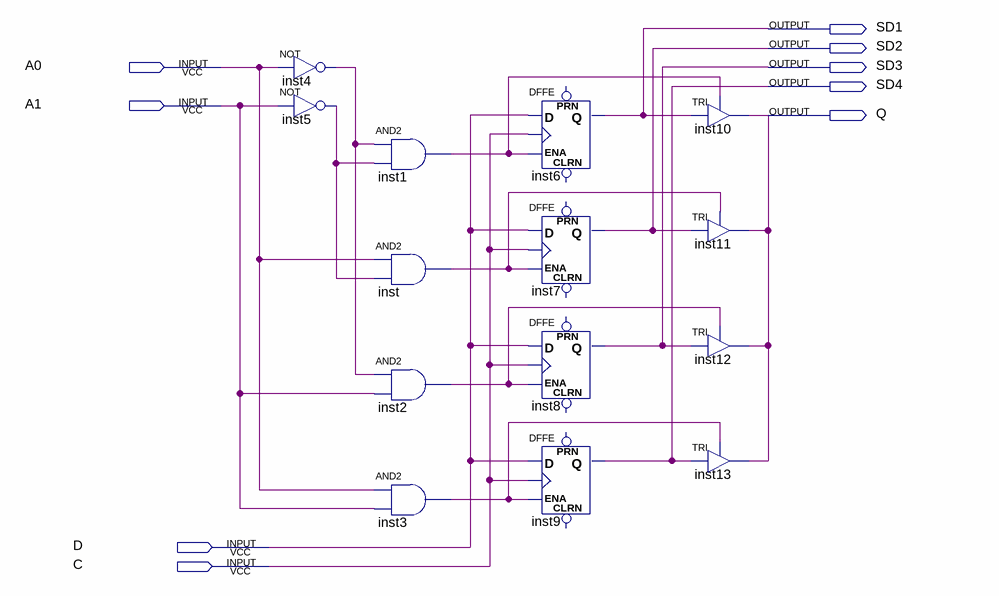
[diagram p0: schematic sheet]
// Quartus schematic Mem4.bdf as structural Verilog: 14 symbols, 9 pins
module Mem4 (
  input  A0,
  input  A1,
  input  D,
  input  C,
  output SD1,
  output SD2,
  output SD3,
  output SD4,
  output Q
);

  wire inst1_out, inst2_out, inst3_out, inst4_out, inst5_out, inst_out;

  not inst4 (inst4_out, A0);
  not inst5 (inst5_out, A1);
  and inst1 (inst1_out, inst4_out, inst5_out);
  and inst (inst_out, A0, inst5_out);
  and inst2 (inst2_out, inst4_out, A1);
  and inst3 (inst3_out, A0, A1);
  DFFE inst6 (.D(D), .CLK(C), .ENA(inst1_out), .Q(SD1));  // open: PRN, CLRN
  DFFE inst7 (.D(D), .CLK(C), .ENA(inst_out), .Q(SD2));  // open: PRN, CLRN
  DFFE inst8 (.D(D), .CLK(C), .ENA(inst2_out), .Q(SD3));  // open: PRN, CLRN
  DFFE inst9 (.D(D), .CLK(C), .ENA(inst3_out), .Q(SD4));  // open: PRN, CLRN
  TRI inst10 (.IN(SD1), .OE(inst1_out), .OUT(Q));
  TRI inst11 (.IN(SD2), .OE(inst_out), .OUT(Q));
  TRI inst12 (.IN(SD3), .OE(inst2_out), .OUT(Q));
  TRI inst13 (.IN(SD4), .OE(inst3_out), .OUT(Q));
endmodule
